# EAGLE schematic msp430_f249_ctk (EAGLE 6.1)
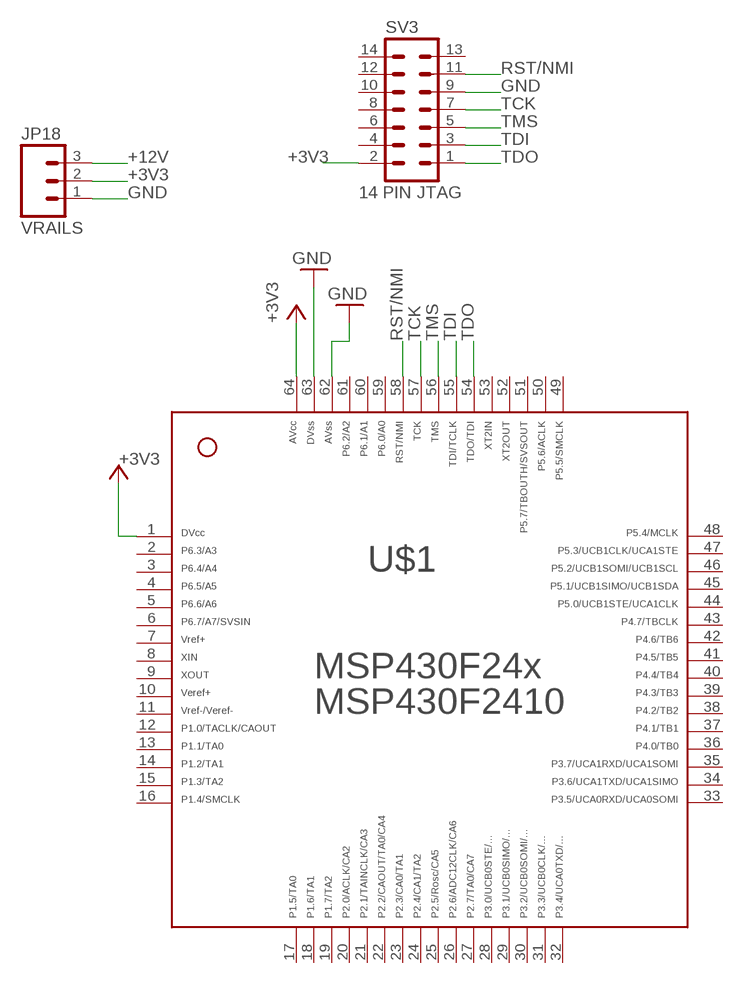
[diagram p0: schematic, sheet 1]

## Parts
JP18  VRAILS  M03SCREW  [SCREWTERMINAL-3.5MM-3]
SV3  14 PIN JTAG  ML14  [ML14]
U$1  F24[X/10]---PM64  [PM/PAG64]

## Nets
+3V3: JP18.2 SV3.2 U$1.1 U$1.64
+12V: JP18.3
GND: JP18.1 SV3.9 U$1.62 U$1.63
RST/NMI: SV3.11 U$1.58
TCK: SV3.7 U$1.57
TDI: SV3.3 U$1.55
TDO: SV3.1 U$1.54
TMS: SV3.5 U$1.56
Unconnected: SV3.4 SV3.6 SV3.8 SV3.10 SV3.12 SV3.13 SV3.14 U$1.2 U$1.3 U$1.4 U$1.5 U$1.6 U$1.7 U$1.8 U$1.9 U$1.10 U$1.11 U$1.12 U$1.13 U$1.14 U$1.15 U$1.16 U$1.17 U$1.18 U$1.19 U$1.20 U$1.21 U$1.22 U$1.23 U$1.24 U$1.25 U$1.26 U$1.27 U$1.28 U$1.29 U$1.30 U$1.31 U$1.32 U$1.33 U$1.34 U$1.35 U$1.36 U$1.37 U$1.38 U$1.39 U$1.40 U$1.41 U$1.42 U$1.43 U$1.44 U$1.45 U$1.46 U$1.47 U$1.48 U$1.49 U$1.50 U$1.51 U$1.52 U$1.53 U$1.59 U$1.60 U$1.61

## Library data of the parts
JP18 = SparkFun-Connectors:M03: Header 3 Standard 3-pin 0.1" header. Use with straight break away headers (SKU : PRT-00116), right angle break away headers (PRT-00553), swiss pins (PRT-00743), machine pins (PRT-00117), and female headers (PRT-00115). Molex polarized connector foot print use with SKU : PRT-08232 with associated crimp pins and housings.
SV3 = con-ml:ML14: HARTING; OC_FARNELL: unknown; OC_NEWARK: unknown
U$1 = TI_MSP430_v16:F24[X/10]---PM64: ***MSP430F24[x/10]***PM64